# Altium project Relay Board.PrjPcb
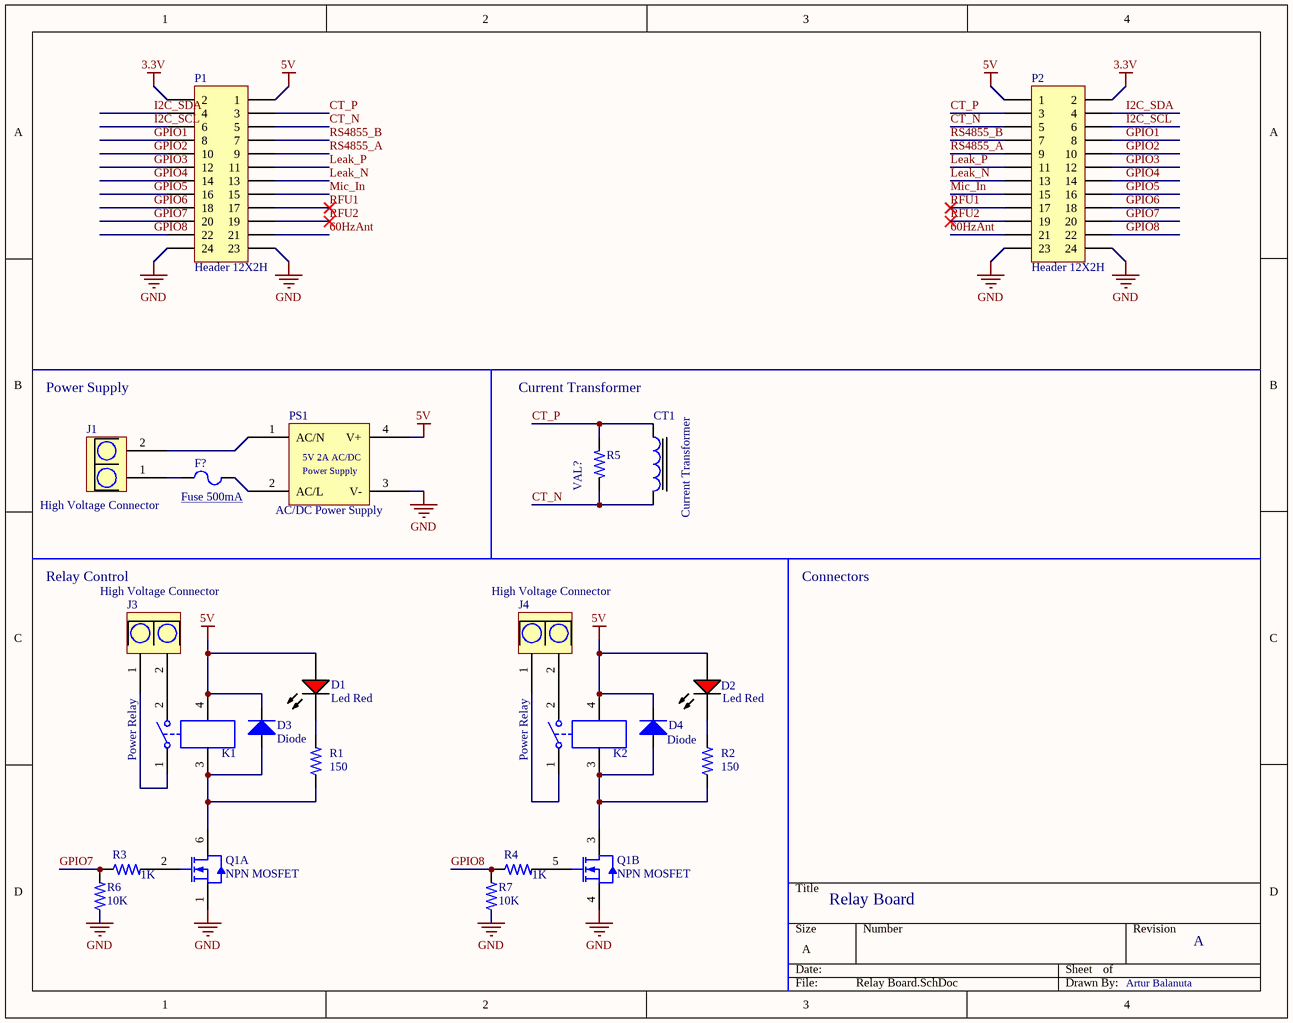
[diagram p0: Relay Board.SchDoc]
1 sheet, 22 parts. Net scope: global (net labels, ports and power ports of the same name join across sheets).

## Sheet Relay Board.SchDoc
size A

### Parts
CT1  Current Transformer  [CT-CR8348]
D1  Led Red  [LED-0603 .7MM TALL]
D2  Led Red  [LED-0603 .7MM TALL]
D3  Diode  [SOD-80  MiniMELF]
D4  Diode  [SOD-80  MiniMELF]
F?  Fuse 500mA  [FUSE M10742X40L Schurter UMK 250 Series]
J1  High Voltage Connector  [2POS Barrier Block Terminal]  (mechanical)
J3  High Voltage Connector  [2POS Barrier Block Terminal]  (mechanical)
J4  High Voltage Connector  [2POS Barrier Block Terminal]  (mechanical)
K1  Power Relay  [T9AS1D12-5]
K2  Power Relay  [T9AS1D12-5]
P1  Header 12X2H  [HDR2X12H]
P2  Header 12X2H  [HDR2X12H]
PS1  AC/DC Power Supply  [IRM-10-5]
Q1  NPN MOSFET  [SC-70-6  (SOT-363)]  (parts A,B of 2)
R1  150  [RESC1608X06L - RES0603]
R2  150  [RESC1608X06L - RES0603]
R3  1K  [RESC1608X06L - RES0603]
R4  1K  [RESC1608X06L - RES0603]
R5  VAL?  [RESC1608X06L - RES0603]
R6  10K  [RESC1608X06L - RES0603]
R7  10K  [RESC1608X06L - RES0603]

### Nets
3.3V: P1.2 P2.2
5V: D1.1(A) D2.1(A) D3.1(K) D4.1(K) K1.4 K2.4 P1.1 P2.1 PS1.4(V+)
GND: P1.23 P1.24 P2.23 P2.24 PS1.3(V-) Q1.1(S1) Q1.4(S2) R6.1 R7.1
60HzAnt: P1.21 P2.21
CT_N: CT1.2 P1.5 P2.5 R5.1
CT_P: CT1.1 P1.3 P2.3 R5.2
GPIO1: P1.8 P2.8
GPIO2: P1.10 P2.10
GPIO3: P1.12 P2.12
GPIO4: P1.14 P2.14
GPIO5: P1.16 P2.16
GPIO6: P1.18 P2.18
GPIO7: P1.20 P2.20 R3.1 R6.2
GPIO8: P1.22 P2.22 R4.1 R7.2
I2C_SCL: P1.6 P2.6
I2C_SDA: P1.4 P2.4
Leak_N: P1.13 P2.13
Leak_P: P1.11 P2.11
Mic_In: P1.15 P2.15
RFU1: P1.17 P2.17
RFU2: P1.19 P2.19
RS4855_A: P1.9 P2.9
RS4855_B: P1.7 P2.7
NetD1_2: D1.2(K) R1.2
NetD2_2: D2.2(K) R2.2
NetD3_2: D3.2(A) K1.3 Q1.6(D1) R1.1
NetD4_2: D4.2(A) K2.3 Q1.3(D2) R2.1
NetF?_1: F?.1 J1.1
NetF?_2: F?.2 PS1.2(AC/L)
NetJ1_2: J1.2 PS1.1(AC/N)
NetJ3_1: J3.1 K1.1
NetJ3_2: J3.2 K1.2
NetJ4_1: J4.1 K2.1
NetJ4_2: J4.2 K2.2
NetQ1_2: Q1.2(G1) R3.2
NetQ1_5: Q1.5(G2) R4.2

### Notes on the sheet
- Power Supply
- Current Transformer
- Relay Control
- Connectors
- Relay Board
- A
- Artur Balanuta
- (in symbol IRM-10-5) 5V 2A AC/DC; Power Supply

### Library data of the parts
CT1 = CT CR8348-2000: TRANSF CURRENT .27" OPENING PCB 50A; url: https://www.digikey.com/product-detail/en/cr-magnetics-inc/CR8348-2000/582-1010-ND/1045166; Supplier 1: Digi-Key; Supplier Part Number 1: 582-1010-ND
D1 D2 = LED0603 RED 20mA 250mcd: LED RED CLEAR 0603 SMD 250 mcd; Supplier 1: Digi-Key; Supplier Part Number 1: 732-4978-1-ND
D3 D4 = Diode LL4150GS18: DIODE GEN 50V 600MA MINI MELF; Supplier 1: Digi-Key; Supplier Part Number 1: LL4150GS18GICT-ND
F? = FUSE-Schurter-3404.2463.22: FUSE UMK 250 FUSE WITH HOLDER 500MA F; URL: https://www.digikey.com/product-detail/en/3404.2463.22/486-3187-1-ND/5225261?curr=usd&WT.z_cid=ref_octopart_dkc_buynow&site=us; Supplier 1: Digi-Key; Supplier Part Number 1: 486-3187-1-ND
J1 J3 J4 = 2POS CONN BARRIER STRIP 2CIRC 0.5" 45A 600V: MOLEX  0386608802; URL: http://www.mouser.com/ProductDetail/Molex/38660-8802/?qs=sGAEpiMZZMsntO7gZZwOWBznzzIjRi3IH61qEmgvOKA%3d; Supplier 1: Digi-Key; Supplier Part Number 1: WM4395-ND
K1 K2 = T9AS1D12-5: Single-Pole Single-Throw Relay; Supplier 1: Digi-Key; Supplier Part Number 1: PB1014-ND; Part Number: T9AS1D12-5
P1 P2 = Header 12X2H: Header, 12-Pin, Dual row, Right Angle; LatestRevisionDate: 17-Jul-2002; LatestRevisionNote: Re-released for DXP Platform.; Publisher: Altium Limited
PS1 = IRM-10-5: AC/DC Power Modules 5V 2A 10W 85-264Vin Encap PS; Supplier 1: Allied; Supplier Part Number 1: 70387823; Mouser Link: http://www.mouser.com/ProductDetail/Mean-Well/IRM-10-5/?qs=sGAEpiMZZMuWiaalG5TUgH52QN1%252bIKAVGLeN4i9HrWU2QI8q%2fOO4Cw%3d%3d
Q1 = SI1922EDH-T1-GE3CT: 2N-CH NPN MOSFET 20V 1.3A SOT-363; Supplier 1: Digi-Key; Supplier Part Number 1: SI1922EDH-T1-GE3CT-ND
R1 R2 = RES0603 150 1% 1/10W_1: SMT 0603 Ceramic Resistor; Supplier 1: Digi-Key; Supplier Part Number 1: 311-150HRCT-ND; Value: 150
R3 R4 = RES0603 1K 1% 1/10W: SMT 0603 Ceramic Resistor; Power: 1/10W; Tolerance: 1%; Value: 1K; Supplier 1: Digi-Key; Supplier 2: Digi-Key; Supplier 3: Digi-Key; Supplier Part Number 1: 311-1.00KHRCT-ND; Supplier Part Number 2: P1.00KHCT-ND; Supplier Part Number 3: RMCF0603FG1K00CT-ND
R5 = RES0603: SMT 0603 Ceramic Resistor; Value: VAL?
R6 R7 = RES0603 10K 1% 1/10W: SMT 0603 Ceramic Resistor; Power: 1/10W; Tolerance: 1%; Supplier 1: Digi-Key; Supplier 2: Digi-Key; Supplier 3: Digi-Key; Supplier Part Number 1: 311-10.0KHRCT-ND; Supplier Part Number 2: RMCF0603FT10K0CT-ND; Supplier Part Number 3: P10.0KHCT-ND; Value: 10K